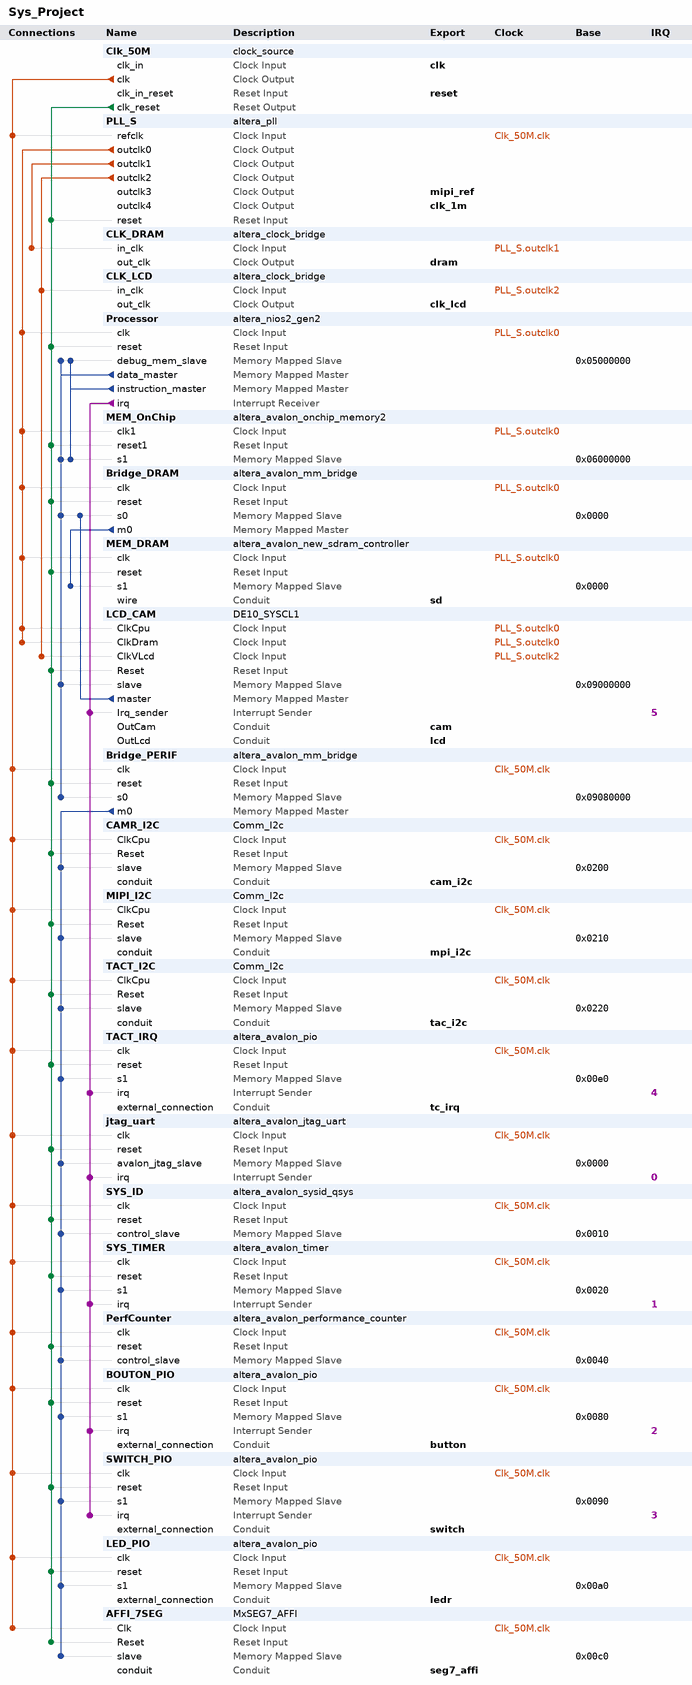
[diagram p0: system contents]
# Platform Designer (Qsys) system Sys_Project, Cyclone V 5CSXFC6D6F31C6
# Parameters at their usual value, and those the tool derives, are not listed.
package require -exact qsys 18.1
create_system Sys_Project
set_project_property DEVICE_FAMILY {Cyclone V}
set_project_property DEVICE 5CSXFC6D6F31C6

add_instance Clk_50M clock_source 18.1
set_instance_parameter_value Clk_50M clockFrequency 50000000

add_instance PLL_S altera_pll 18.1
set_instance_parameter_value PLL_S gui_device_speed_grade 1
set_instance_parameter_value PLL_S gui_number_of_clocks 5
set_instance_parameter_value PLL_S gui_operation_mode direct
set_instance_parameter_value PLL_S gui_output_clock_frequency0 100.0
set_instance_parameter_value PLL_S gui_output_clock_frequency1 100.0
set_instance_parameter_value PLL_S gui_output_clock_frequency2 25.0
set_instance_parameter_value PLL_S gui_output_clock_frequency3 20.0
set_instance_parameter_value PLL_S gui_phase_shift2 -75
set_instance_parameter_value PLL_S gui_phase_shift_deg1 -75.0
set_instance_parameter_value PLL_S gui_pll_mode {Integer-N PLL}
set_instance_parameter_value PLL_S gui_ps_units1 degrees
set_instance_parameter_value PLL_S gui_ps_units2 degrees
set_instance_parameter_value PLL_S gui_reference_clock_frequency 50.0
set_instance_parameter_value PLL_S gui_use_locked false

add_instance CLK_DRAM altera_clock_bridge 18.1
set_instance_parameter_value CLK_DRAM DERIVED_CLOCK_RATE 100000000
set_instance_parameter_value CLK_DRAM EXPLICIT_CLOCK_RATE 0

add_instance CLK_LCD altera_clock_bridge 18.1
set_instance_parameter_value CLK_LCD DERIVED_CLOCK_RATE 25000000
set_instance_parameter_value CLK_LCD EXPLICIT_CLOCK_RATE 3

add_instance Processor altera_nios2_gen2 18.1
set_instance_parameter_value Processor dcache_size 4096
set_instance_parameter_value Processor exceptionSlave MEM_OnChip.s1
set_instance_parameter_value Processor icache_size 4096
set_instance_parameter_value Processor impl Tiny
set_instance_parameter_value Processor resetSlave MEM_OnChip.s1

add_instance MEM_OnChip altera_avalon_onchip_memory2 18.1
set_instance_parameter_value MEM_OnChip dataWidth 32
set_instance_parameter_value MEM_OnChip dualPort false
set_instance_parameter_value MEM_OnChip initMemContent false
set_instance_parameter_value MEM_OnChip initializationFileName onchip_mem.hex
set_instance_parameter_value MEM_OnChip memorySize 163840

add_instance Bridge_DRAM altera_avalon_mm_bridge 18.1
set_instance_parameter_value Bridge_DRAM ADDRESS_UNITS SYMBOLS
set_instance_parameter_value Bridge_DRAM ADDRESS_WIDTH 10
set_instance_parameter_value Bridge_DRAM DATA_WIDTH 32
set_instance_parameter_value Bridge_DRAM MAX_BURST_SIZE 32
set_instance_parameter_value Bridge_DRAM MAX_PENDING_RESPONSES 4
set_instance_parameter_value Bridge_DRAM USE_AUTO_ADDRESS_WIDTH 1

add_instance MEM_DRAM altera_avalon_new_sdram_controller 18.1
set_instance_parameter_value MEM_DRAM TAC 5.5
set_instance_parameter_value MEM_DRAM TRCD 20.0
set_instance_parameter_value MEM_DRAM TRP 20.0
set_instance_parameter_value MEM_DRAM casLatency 3
set_instance_parameter_value MEM_DRAM columnWidth 10
set_instance_parameter_value MEM_DRAM dataWidth 16
set_instance_parameter_value MEM_DRAM generateSimulationModel false
set_instance_parameter_value MEM_DRAM model single_Micron_MT48LC4M32B2_7_chip
set_instance_parameter_value MEM_DRAM numberOfBanks 4
set_instance_parameter_value MEM_DRAM numberOfChipSelects 1
set_instance_parameter_value MEM_DRAM powerUpDelay 100.0
set_instance_parameter_value MEM_DRAM refreshPeriod 15.625
set_instance_parameter_value MEM_DRAM rowWidth 13

add_instance LCD_CAM DE10_SYSCL1 12.1

add_instance Bridge_PERIF altera_avalon_mm_bridge 18.1
set_instance_parameter_value Bridge_PERIF ADDRESS_UNITS SYMBOLS
set_instance_parameter_value Bridge_PERIF ADDRESS_WIDTH 10
set_instance_parameter_value Bridge_PERIF DATA_WIDTH 32
set_instance_parameter_value Bridge_PERIF MAX_PENDING_RESPONSES 4
set_instance_parameter_value Bridge_PERIF USE_AUTO_ADDRESS_WIDTH 1

add_instance CAMR_I2C Comm_I2c 12.1

add_instance MIPI_I2C Comm_I2c 12.1

add_instance TACT_I2C Comm_I2c 12.1

add_instance TACT_IRQ altera_avalon_pio 18.1
set_instance_parameter_value TACT_IRQ bitClearingEdgeCapReg true
set_instance_parameter_value TACT_IRQ captureEdge true
set_instance_parameter_value TACT_IRQ direction Input
set_instance_parameter_value TACT_IRQ edgeType FALLING
set_instance_parameter_value TACT_IRQ generateIRQ true
set_instance_parameter_value TACT_IRQ irqType EDGE
set_instance_parameter_value TACT_IRQ simDoTestBenchWiring true
set_instance_parameter_value TACT_IRQ width 1

add_instance jtag_uart altera_avalon_jtag_uart 18.1
set_instance_parameter_value jtag_uart allowMultipleConnections true
set_instance_parameter_value jtag_uart readBufferDepth 512
set_instance_parameter_value jtag_uart simInteractiveOptions INTERACTIVE_ASCII_OUTPUT
set_instance_parameter_value jtag_uart writeBufferDepth 512

add_instance SYS_ID altera_avalon_sysid_qsys 18.1
set_instance_parameter_value SYS_ID id -1395322110

add_instance SYS_TIMER altera_avalon_timer 18.1
set_instance_parameter_value SYS_TIMER period 1
set_instance_parameter_value SYS_TIMER periodUnits MSEC

add_instance PerfCounter altera_avalon_performance_counter 18.1
set_instance_parameter_value PerfCounter numberOfSections 3

add_instance BOUTON_PIO altera_avalon_pio 18.1
set_instance_parameter_value BOUTON_PIO bitClearingEdgeCapReg true
set_instance_parameter_value BOUTON_PIO captureEdge true
set_instance_parameter_value BOUTON_PIO direction Input
set_instance_parameter_value BOUTON_PIO edgeType FALLING
set_instance_parameter_value BOUTON_PIO generateIRQ true
set_instance_parameter_value BOUTON_PIO irqType EDGE
set_instance_parameter_value BOUTON_PIO simDoTestBenchWiring true
set_instance_parameter_value BOUTON_PIO width 3

add_instance SWITCH_PIO altera_avalon_pio 18.1
set_instance_parameter_value SWITCH_PIO bitClearingEdgeCapReg true
set_instance_parameter_value SWITCH_PIO captureEdge true
set_instance_parameter_value SWITCH_PIO direction Input
set_instance_parameter_value SWITCH_PIO edgeType ANY
set_instance_parameter_value SWITCH_PIO generateIRQ true
set_instance_parameter_value SWITCH_PIO irqType EDGE
set_instance_parameter_value SWITCH_PIO width 4

add_instance LED_PIO altera_avalon_pio 18.1
set_instance_parameter_value LED_PIO bitModifyingOutReg true
set_instance_parameter_value LED_PIO direction Output
set_instance_parameter_value LED_PIO width 4

add_instance AFFI_7SEG MxSEG7_AFFI 12.1
set_instance_parameter_value AFFI_7SEG INIT_VAL 0
set_instance_parameter_value AFFI_7SEG NBR_7SEG 2

# connections
add_connection Clk_50M.clk AFFI_7SEG.Clk clock
add_connection Clk_50M.clk BOUTON_PIO.clk clock
add_connection Clk_50M.clk Bridge_PERIF.clk clock
add_connection Clk_50M.clk CAMR_I2C.ClkCpu clock
add_connection Clk_50M.clk jtag_uart.clk clock
add_connection Clk_50M.clk LED_PIO.clk clock
add_connection Clk_50M.clk MIPI_I2C.ClkCpu clock
add_connection Clk_50M.clk PerfCounter.clk clock
add_connection Clk_50M.clk PLL_S.refclk clock
add_connection Clk_50M.clk SWITCH_PIO.clk clock
add_connection Clk_50M.clk SYS_ID.clk clock
add_connection Clk_50M.clk SYS_TIMER.clk clock
add_connection Clk_50M.clk TACT_I2C.ClkCpu clock
add_connection Clk_50M.clk TACT_IRQ.clk clock
add_connection PLL_S.outclk0 Bridge_DRAM.clk clock
add_connection PLL_S.outclk0 LCD_CAM.ClkCpu clock
add_connection PLL_S.outclk0 LCD_CAM.ClkDram clock
add_connection PLL_S.outclk0 MEM_DRAM.clk clock
add_connection PLL_S.outclk0 MEM_OnChip.clk1 clock
add_connection PLL_S.outclk0 Processor.clk clock
add_connection PLL_S.outclk1 CLK_DRAM.in_clk clock
add_connection PLL_S.outclk2 CLK_LCD.in_clk clock
add_connection PLL_S.outclk2 LCD_CAM.ClkVLcd clock
add_connection Clk_50M.clk_reset AFFI_7SEG.Reset reset
add_connection Clk_50M.clk_reset BOUTON_PIO.reset reset
add_connection Clk_50M.clk_reset Bridge_DRAM.reset reset
add_connection Clk_50M.clk_reset Bridge_PERIF.reset reset
add_connection Clk_50M.clk_reset CAMR_I2C.Reset reset
add_connection Clk_50M.clk_reset jtag_uart.reset reset
add_connection Clk_50M.clk_reset LCD_CAM.Reset reset
add_connection Clk_50M.clk_reset LED_PIO.reset reset
add_connection Clk_50M.clk_reset MEM_DRAM.reset reset
add_connection Clk_50M.clk_reset MEM_OnChip.reset1 reset
add_connection Clk_50M.clk_reset MIPI_I2C.Reset reset
add_connection Clk_50M.clk_reset PerfCounter.reset reset
add_connection Clk_50M.clk_reset PLL_S.reset reset
add_connection Clk_50M.clk_reset Processor.reset reset
add_connection Clk_50M.clk_reset SWITCH_PIO.reset reset
add_connection Clk_50M.clk_reset SYS_ID.reset reset
add_connection Clk_50M.clk_reset SYS_TIMER.reset reset
add_connection Clk_50M.clk_reset TACT_I2C.Reset reset
add_connection Clk_50M.clk_reset TACT_IRQ.reset reset
add_connection Bridge_DRAM.m0 MEM_DRAM.s1 avalon
set_connection_parameter_value Bridge_DRAM.m0/MEM_DRAM.s1 baseAddress 0x0000
add_connection Bridge_PERIF.m0 AFFI_7SEG.slave avalon
set_connection_parameter_value Bridge_PERIF.m0/AFFI_7SEG.slave baseAddress 0x00c0
add_connection Bridge_PERIF.m0 BOUTON_PIO.s1 avalon
set_connection_parameter_value Bridge_PERIF.m0/BOUTON_PIO.s1 baseAddress 0x0080
add_connection Bridge_PERIF.m0 CAMR_I2C.slave avalon
set_connection_parameter_value Bridge_PERIF.m0/CAMR_I2C.slave baseAddress 0x0200
add_connection Bridge_PERIF.m0 jtag_uart.avalon_jtag_slave avalon
set_connection_parameter_value Bridge_PERIF.m0/jtag_uart.avalon_jtag_slave baseAddress 0x0000
add_connection Bridge_PERIF.m0 LED_PIO.s1 avalon
set_connection_parameter_value Bridge_PERIF.m0/LED_PIO.s1 baseAddress 0x00a0
add_connection Bridge_PERIF.m0 MIPI_I2C.slave avalon
set_connection_parameter_value Bridge_PERIF.m0/MIPI_I2C.slave baseAddress 0x0210
add_connection Bridge_PERIF.m0 PerfCounter.control_slave avalon
set_connection_parameter_value Bridge_PERIF.m0/PerfCounter.control_slave baseAddress 0x0040
add_connection Bridge_PERIF.m0 SWITCH_PIO.s1 avalon
set_connection_parameter_value Bridge_PERIF.m0/SWITCH_PIO.s1 baseAddress 0x0090
add_connection Bridge_PERIF.m0 SYS_ID.control_slave avalon
set_connection_parameter_value Bridge_PERIF.m0/SYS_ID.control_slave baseAddress 0x0010
add_connection Bridge_PERIF.m0 SYS_TIMER.s1 avalon
set_connection_parameter_value Bridge_PERIF.m0/SYS_TIMER.s1 baseAddress 0x0020
add_connection Bridge_PERIF.m0 TACT_I2C.slave avalon
set_connection_parameter_value Bridge_PERIF.m0/TACT_I2C.slave baseAddress 0x0220
add_connection Bridge_PERIF.m0 TACT_IRQ.s1 avalon
set_connection_parameter_value Bridge_PERIF.m0/TACT_IRQ.s1 baseAddress 0x00e0
add_connection LCD_CAM.master Bridge_DRAM.s0 avalon
set_connection_parameter_value LCD_CAM.master/Bridge_DRAM.s0 baseAddress 0x0000
add_connection Processor.data_master Bridge_DRAM.s0 avalon
set_connection_parameter_value Processor.data_master/Bridge_DRAM.s0 baseAddress 0x0000
add_connection Processor.data_master Bridge_PERIF.s0 avalon
set_connection_parameter_value Processor.data_master/Bridge_PERIF.s0 baseAddress 0x09080000
add_connection Processor.data_master LCD_CAM.slave avalon
set_connection_parameter_value Processor.data_master/LCD_CAM.slave baseAddress 0x09000000
add_connection Processor.data_master MEM_OnChip.s1 avalon
set_connection_parameter_value Processor.data_master/MEM_OnChip.s1 baseAddress 0x06000000
add_connection Processor.data_master Processor.debug_mem_slave avalon
set_connection_parameter_value Processor.data_master/Processor.debug_mem_slave baseAddress 0x05000000
add_connection Processor.instruction_master MEM_OnChip.s1 avalon
set_connection_parameter_value Processor.instruction_master/MEM_OnChip.s1 baseAddress 0x06000000
add_connection Processor.instruction_master Processor.debug_mem_slave avalon
set_connection_parameter_value Processor.instruction_master/Processor.debug_mem_slave baseAddress 0x05000000
add_connection Processor.irq BOUTON_PIO.irq interrupt
set_connection_parameter_value Processor.irq/BOUTON_PIO.irq irqNumber 2
add_connection Processor.irq jtag_uart.irq interrupt
set_connection_parameter_value Processor.irq/jtag_uart.irq irqNumber 0
add_connection Processor.irq LCD_CAM.Irq_sender interrupt
set_connection_parameter_value Processor.irq/LCD_CAM.Irq_sender irqNumber 5
add_connection Processor.irq SWITCH_PIO.irq interrupt
set_connection_parameter_value Processor.irq/SWITCH_PIO.irq irqNumber 3
add_connection Processor.irq SYS_TIMER.irq interrupt
set_connection_parameter_value Processor.irq/SYS_TIMER.irq irqNumber 1
add_connection Processor.irq TACT_IRQ.irq interrupt
set_connection_parameter_value Processor.irq/TACT_IRQ.irq irqNumber 4

# exported interfaces
add_interface button conduit end
set_interface_property button EXPORT_OF BOUTON_PIO.external_connection
add_interface cam conduit end
set_interface_property cam EXPORT_OF LCD_CAM.OutCam
add_interface cam_i2c conduit end
set_interface_property cam_i2c EXPORT_OF CAMR_I2C.conduit
add_interface clk clock sink
set_interface_property clk EXPORT_OF Clk_50M.clk_in
add_interface clk_1m clock source
set_interface_property clk_1m EXPORT_OF PLL_S.outclk4
add_interface clk_lcd clock source
set_interface_property clk_lcd EXPORT_OF CLK_LCD.out_clk
add_interface dram clock source
set_interface_property dram EXPORT_OF CLK_DRAM.out_clk
add_interface lcd conduit end
set_interface_property lcd EXPORT_OF LCD_CAM.OutLcd
add_interface ledr conduit end
set_interface_property ledr EXPORT_OF LED_PIO.external_connection
add_interface mipi_ref clock source
set_interface_property mipi_ref EXPORT_OF PLL_S.outclk3
add_interface mpi_i2c conduit end
set_interface_property mpi_i2c EXPORT_OF MIPI_I2C.conduit
add_interface reset reset sink
set_interface_property reset EXPORT_OF Clk_50M.clk_in_reset
add_interface sd conduit end
set_interface_property sd EXPORT_OF MEM_DRAM.wire
add_interface seg7_affi conduit end
set_interface_property seg7_affi EXPORT_OF AFFI_7SEG.conduit
add_interface switch conduit end
set_interface_property switch EXPORT_OF SWITCH_PIO.external_connection
add_interface tac_i2c conduit end
set_interface_property tac_i2c EXPORT_OF TACT_I2C.conduit
add_interface tc_irq conduit end
set_interface_property tc_irq EXPORT_OF TACT_IRQ.external_connection

set_interconnect_requirement {$system} qsys_mm.clockCrossingAdapter HANDSHAKE
set_interconnect_requirement {$system} qsys_mm.maxAdditionalLatency 1

save_system Sys_Project.qsys
